# Altium schematic sheet Gamepads.SchDoc
size A4; SheetNumber: 10; SheetTotal: 15
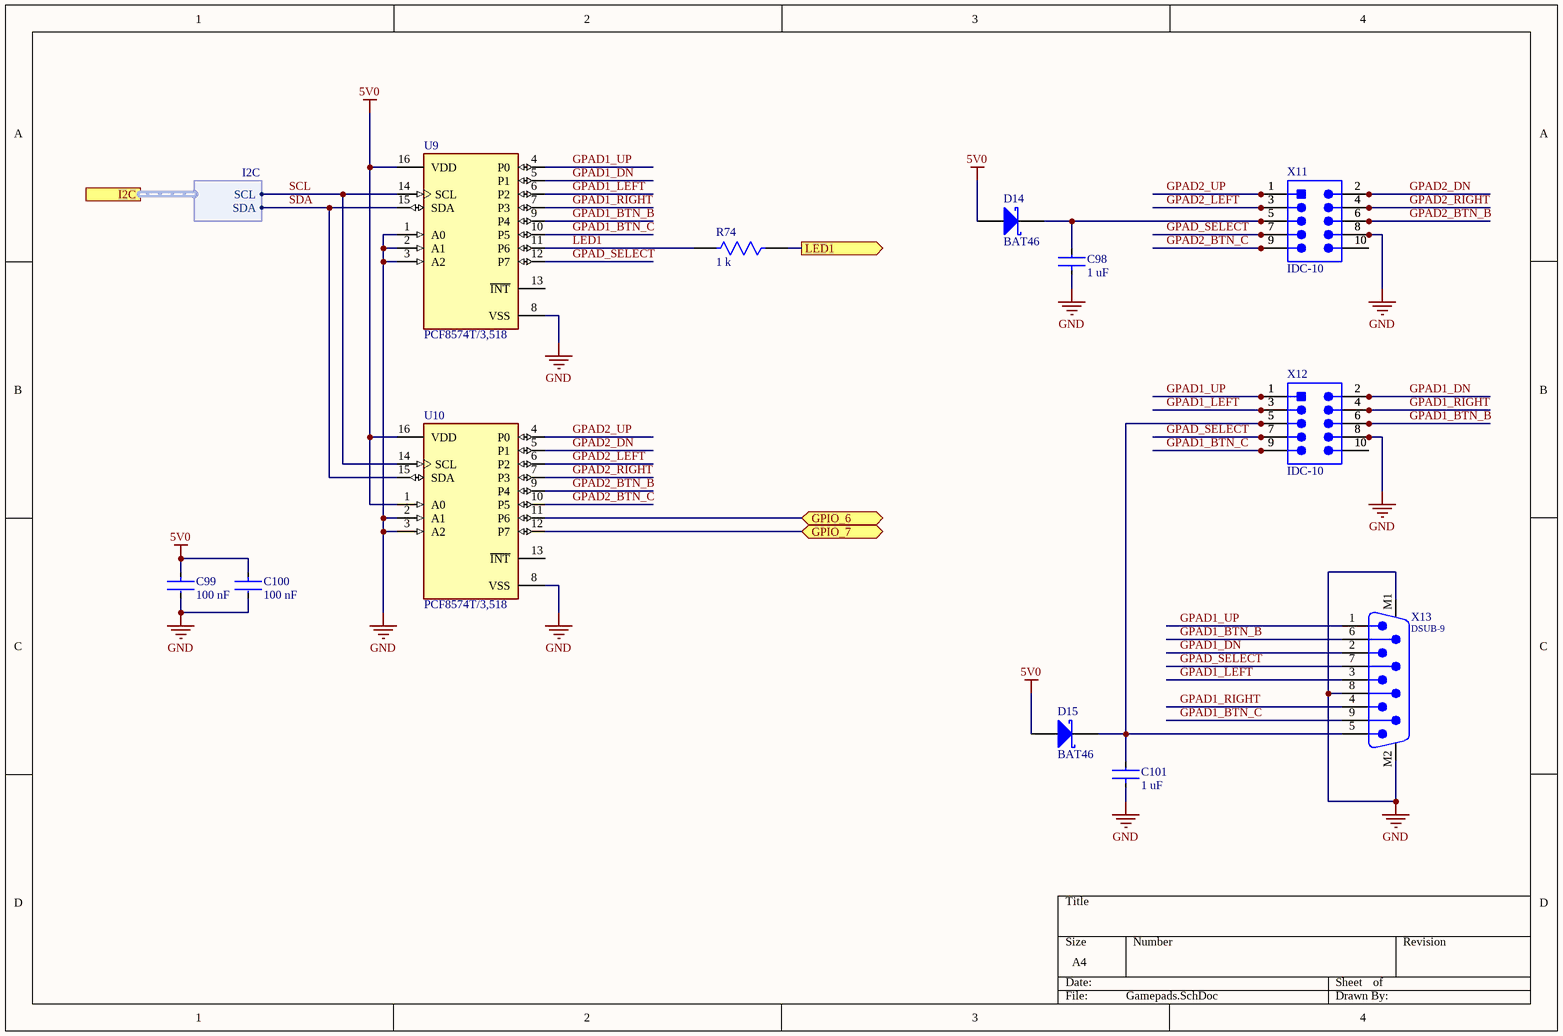
[diagram p0: Gamepads.SchDoc]

## Parts
C98  Capacitance: 1 uF  [CC0805]  (hidden comment: CC0805-1.5pF)
C99  Capacitance: 100 nF  [CC0805]  (hidden comment: CC0805-1.5pF)
C100  Capacitance: 100 nF  [CC0805]  (hidden comment: CC0805-1.5pF)
C101  Capacitance: 1 uF  [CC0805]  (hidden comment: CC0805-1.5pF)
D14  BAT46  [STM-DO-35-2]
D15  BAT46  [STM-DO-35-2]
R74  Resistance: 1 k  [CR0805]  (hidden comment: CR0805-51)
U9  PCF8574T/3,518  [FP-SOT162-1-MFG]
U10  PCF8574T/3,518  [FP-SOT162-1-MFG]
X11  IDC-10  [BH-10]
X12  IDC-10  [BH-10]
X13  DSUB-9  [618009231221]

## Ports
GPIO_6 (bidir), GPIO_7 (bidir), I2C (harness I2C), LED1 (out)

## Harnesses
I2C: SDA, SCL

## Nets
5V0: C99.1 C100.1 D14.1(A) D15.1(A) U9.16(VDD) U10.1(A0) U10.16(VDD)
GND: C98.1 C99.2 C100.2 C101.1 U9.1(A0) U9.2(A1) U9.3(A2) U9.8(VSS) U10.2(A1) U10.3(A2) U10.8(VSS) X11.8 X12.8 X13.8 X13.M1 X13.M2
GPAD1_BTN_B: U9.9(P4) X12.6 X13.6
GPAD1_BTN_C: U9.10(P5) X12.9 X13.9
GPAD1_DN: U9.5(P1) X12.2 X13.2
GPAD1_LEFT: U9.6(P2) X12.3 X13.3
GPAD1_RIGHT: U9.7(P3) X12.4 X13.4
GPAD1_UP: U9.4(P0) X12.1 X13.1
GPAD2_BTN_B: U10.9(P4) X11.6
GPAD2_BTN_C: U10.10(P5) X11.9
GPAD2_DN: U10.5(P1) X11.2
GPAD2_LEFT: U10.6(P2) X11.3
GPAD2_RIGHT: U10.7(P3) X11.4
GPAD2_UP: U10.4(P0) X11.1
GPAD_SELECT: U9.12(P7) X11.7 X12.7 X13.7
GPIO_6: U10.11(P6) ; port GPIO_6
GPIO_7: U10.12(P7) ; port GPIO_7
LED1: R74.2 U9.11(P6)
LED1: R74.1 ; port LED1  [a separate net that carries the same name]
SCL: U9.14(SCL) U10.14(SCL) ; port I2C.SCL
SDA: U9.15(SDA) U10.15(SDA) ; port I2C.SDA
NetC98_2: C98.2 D14.2(K) X11.5
NetC101_2: C101.2 D15.2(K) X12.5 X13.5

Not connected (* = marked no-connect by the designer): U9 13(~{INT}); U10 13(~{INT}); X11 10; X12 10

## Library data of the parts
C98 C101 = CC0805: CL21 Series 0805 1.5pF 50V ±0.25pF Tolerance C0G Multilayer Ceramic Chip Capacitor; Manufacturer: Samsung; Manufacturer Part Number: CL21C1R5CBANNNC; Case/Package: 0805; value: 1.5pF; Category: Cap
C99 C100 = CC0805: CL21 Series 0805 1.5pF 50V ±0.25pF Tolerance C0G Multilayer Ceramic Chip Capacitor; Manufacturer Part Number: CL21C1R5CBANNNC; Manufacturer: Samsung; Category: Cap; value: 1.5pF; Case/Package: 0805
D14 D15 = BAT46: Small Signal Schottky Diode, 150 mA, 100 V, -65 to 125 degC, 2-Pin DO-35, RoHS, Tape and Reel; Manufacturer: STMicroelectronics; Manufacturer Part Number: BAT46; value: BAT46; Category: Diode
R74 = CR0805: 51Ω ±0.5% 0.1W 1/10W Chip Resistor 0805 (2012 Metric) Thin Film; Manufacturer: Susumu; Manufacturer Part Number: RR1220Q-510-D; Case/Package: 0805; Number of Terminations: 2; value: 51Ω; Category: Res; Termination: SMD/SMT; Number of Pins: 2
U9 U10 = PCF8574T/3,518: IC I/O EXPANDER I2C 8B 16SOIC; Manufacturer: NXP Semiconductors; Manufacturer Part Number: PCF8574T/3,518; Category: IC; value: PCF8574T/3,518; Case/Package: SOT162-1
X11 X12 = IDC-10: Male Header, Pitch 2.54 mm, 2 x 5 Postion, Height 9.91 mm, Tail Length 2.84 mm, -55 to 105 degC, RoHS, Bulk; PartNumber: N2510; Manufacturer: 3M; Manufacturer Part Number: N2510-6002RB; Pitch: 2.54mm; value: 10-Pin Shrouded Header, 2.54mm; Case/Package: IDC-10; Category: Connector
X13 = DSUB-9_1: Male PCB Connector with Hex Screw WR-DSUB, 8.08 mm, Angled, 9 pins; Manufacturer: Wurth Electronics; value: DSUB, Angled, 9 pins; Manufacturer Part Number: 618009231221; Case/Package: DSUB-9; Category: Connector